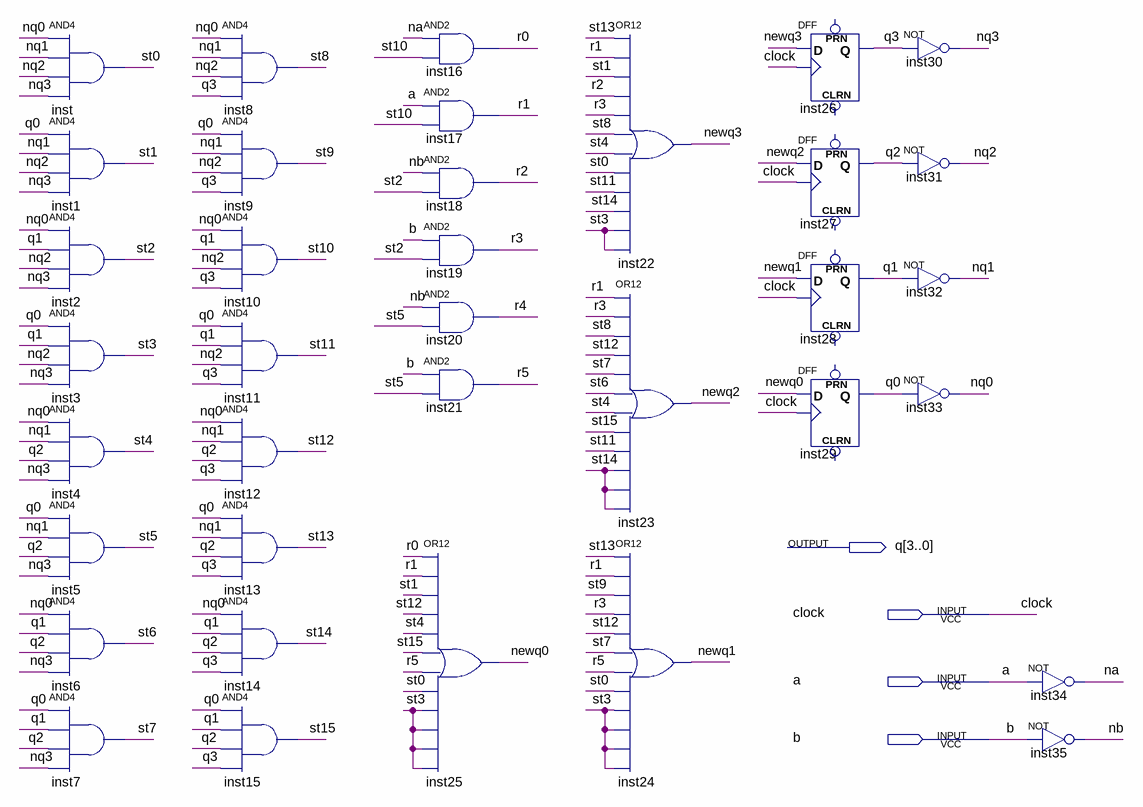
[diagram p0: schematic sheet]
// Quartus schematic Prac6.bdf as structural Verilog: 36 symbols, 4 pins
module Prac6 (
  input  clock,
  input  a,
  input  b,
  output [3:0] q
);

  wire na, nb, newq0, newq1, newq2, newq3, nq0, nq1, nq2, nq3, r0, r1, r2, r3, r4, r5, st0, st1, st2, st3,
       st4, st5, st6, st7, st8, st9, st10, st11, st12, st13, st14, st15;

  and inst (st0, nq0, nq1, nq2, nq3);
  and inst1 (st1, q[0], nq1, nq2, nq3);
  and inst2 (st2, nq0, q[1], nq2, nq3);
  and inst3 (st3, q[0], q[1], nq2, nq3);
  and inst4 (st4, nq0, nq1, q[2], nq3);
  and inst5 (st5, q[0], nq1, q[2], nq3);
  and inst6 (st6, nq0, q[1], q[2], nq3);
  and inst7 (st7, q[0], q[1], q[2], nq3);
  and inst8 (st8, nq0, nq1, nq2, q[3]);
  and inst9 (st9, q[0], nq1, nq2, q[3]);
  and inst10 (st10, nq0, q[1], nq2, q[3]);
  and inst11 (st11, q[0], q[1], nq2, q[3]);
  and inst12 (st12, nq0, nq1, q[2], q[3]);
  and inst13 (st13, q[0], nq1, q[2], q[3]);
  and inst14 (st14, nq0, q[1], q[2], q[3]);
  and inst15 (st15, q[0], q[1], q[2], q[3]);
  and inst16 (r0, na, st10);
  and inst17 (r1, a, st10);
  and inst18 (r2, nb, st2);
  and inst19 (r3, b, st2);
  and inst20 (r4, nb, st5);
  and inst21 (r5, b, st5);
  or inst25 (newq0, r0, r1, st1, st12, st4, st15, r5, st0, st3, st3, st3, st3);
  or inst22 (newq3, st13, r1, st1, r2, r3, st8, st4, st0, st11, st14, st3, st3);
  or inst23 (newq2, r1, r3, st8, st12, st7, st6, st4, st15, st11, st14, st14, st14);
  or inst24 (newq1, st13, r1, st9, r3, st12, st7, r5, st0, st3, st3, st3, st3);
  DFF inst26 (.CLK(clock), .D(newq3), .Q(q[3]));  // open: CLRN, PRN
  DFF inst27 (.CLK(clock), .D(newq2), .Q(q[2]));  // open: CLRN, PRN
  DFF inst28 (.CLK(clock), .D(newq1), .Q(q[1]));  // open: CLRN, PRN
  DFF inst29 (.CLK(clock), .D(newq0), .Q(q[0]));  // open: CLRN, PRN
  not inst30 (nq3, q[3]);
  not inst31 (nq2, q[2]);
  not inst32 (nq1, q[1]);
  not inst33 (nq0, q[0]);
  not inst34 (na, a);
  not inst35 (nb, b);
endmodule
